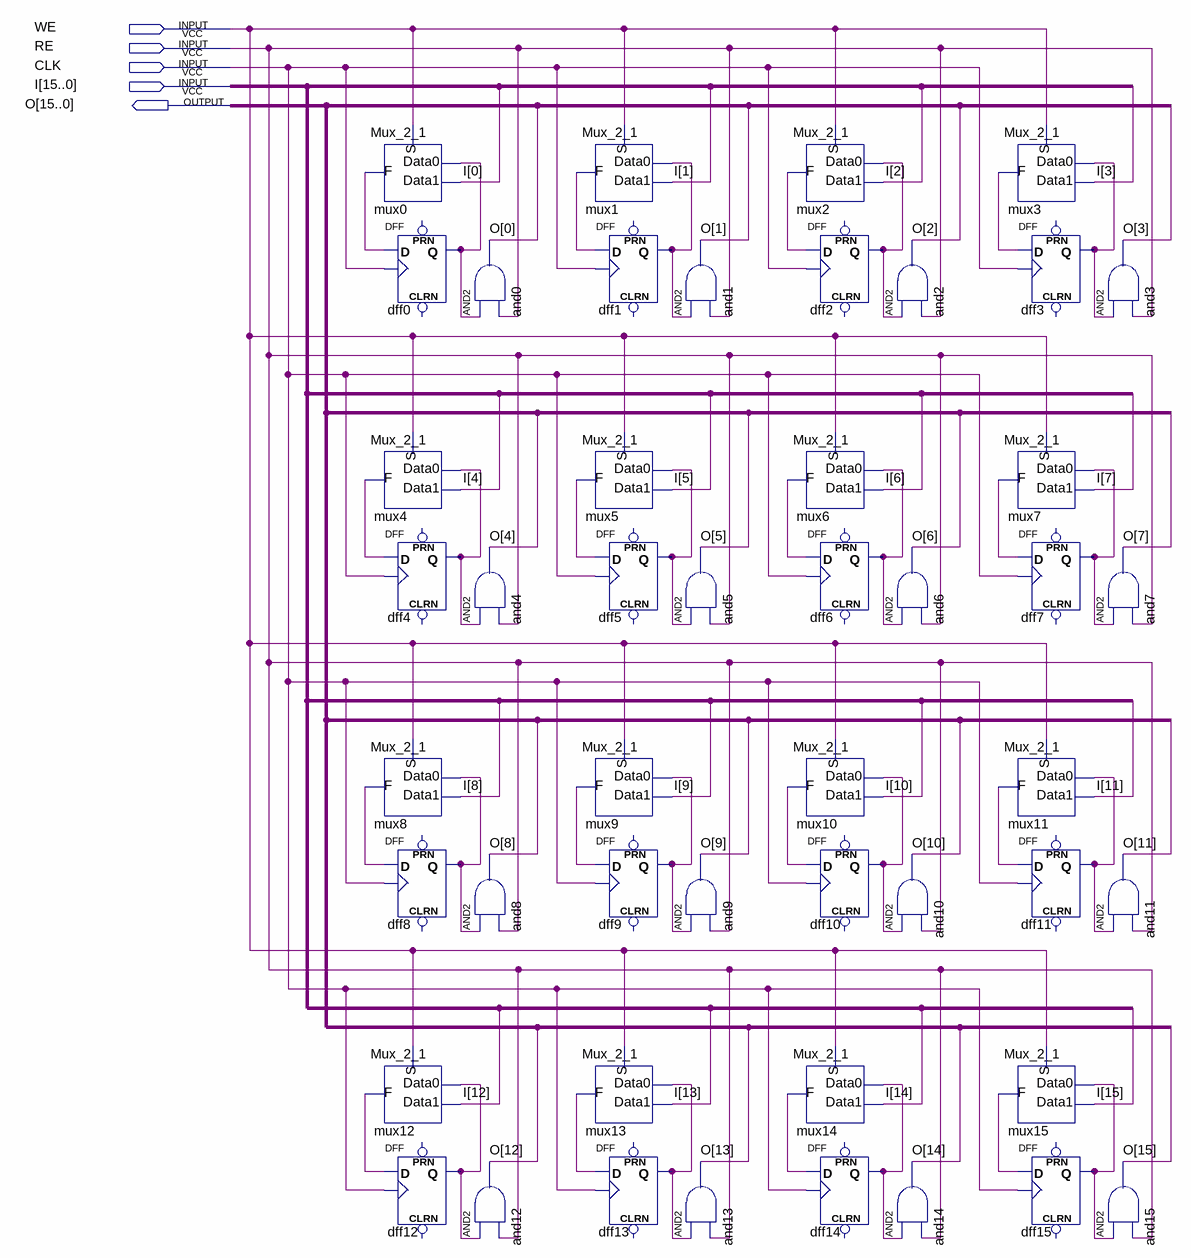
[diagram p0: schematic sheet]
// Quartus schematic Register16.bdf as structural Verilog: 48 symbols, 5 pins
module Register16 (
  input  WE,
  input  RE,
  input  CLK,
  input  [15:0] I,
  output [15:0] O
);

  wire dff0_q, dff1_q, dff2_q, dff3_q, dff4_q, dff5_q, dff6_q, dff7_q, dff8_q, dff9_q, dff10_q, dff11_q,
       dff12_q, dff13_q, dff14_q, dff15_q, mux0_f, mux1_f, mux2_f, mux3_f, mux4_f, mux5_f, mux6_f, mux7_f,
       mux8_f, mux9_f, mux10_f, mux11_f, mux12_f, mux13_f, mux14_f, mux15_f;

  Mux_2_1 mux0 (.S(WE), .Data0(dff0_q), .Data1(I[0]), .F(mux0_f));
  Mux_2_1 mux4 (.S(WE), .Data0(dff4_q), .Data1(I[4]), .F(mux4_f));
  Mux_2_1 mux8 (.S(WE), .Data0(dff8_q), .Data1(I[8]), .F(mux8_f));
  Mux_2_1 mux12 (.S(WE), .Data0(dff12_q), .Data1(I[12]), .F(mux12_f));
  DFF dff0 (.CLK(CLK), .D(mux0_f), .Q(dff0_q));  // open: CLRN, PRN
  DFF dff4 (.CLK(CLK), .D(mux4_f), .Q(dff4_q));  // open: CLRN, PRN
  DFF dff8 (.CLK(CLK), .D(mux8_f), .Q(dff8_q));  // open: CLRN, PRN
  DFF dff12 (.CLK(CLK), .D(mux12_f), .Q(dff12_q));  // open: CLRN, PRN
  and and0 (O[0], dff0_q, RE);
  and and4 (O[4], dff4_q, RE);
  and and8 (O[8], dff8_q, RE);
  and and12 (O[12], dff12_q, RE);
  Mux_2_1 mux1 (.S(WE), .Data0(dff1_q), .Data1(I[1]), .F(mux1_f));
  DFF dff1 (.CLK(CLK), .D(mux1_f), .Q(dff1_q));  // open: CLRN, PRN
  Mux_2_1 mux5 (.S(WE), .Data0(dff5_q), .Data1(I[5]), .F(mux5_f));
  DFF dff5 (.CLK(CLK), .D(mux5_f), .Q(dff5_q));  // open: CLRN, PRN
  Mux_2_1 mux9 (.S(WE), .Data0(dff9_q), .Data1(I[9]), .F(mux9_f));
  DFF dff9 (.CLK(CLK), .D(mux9_f), .Q(dff9_q));  // open: CLRN, PRN
  Mux_2_1 mux13 (.S(WE), .Data0(dff13_q), .Data1(I[13]), .F(mux13_f));
  DFF dff13 (.CLK(CLK), .D(mux13_f), .Q(dff13_q));  // open: CLRN, PRN
  and and1 (O[1], dff1_q, RE);
  and and5 (O[5], dff5_q, RE);
  and and9 (O[9], dff9_q, RE);
  and and13 (O[13], dff13_q, RE);
  Mux_2_1 mux2 (.S(WE), .Data0(dff2_q), .Data1(I[2]), .F(mux2_f));
  DFF dff2 (.CLK(CLK), .D(mux2_f), .Q(dff2_q));  // open: CLRN, PRN
  Mux_2_1 mux6 (.S(WE), .Data0(dff6_q), .Data1(I[6]), .F(mux6_f));
  DFF dff6 (.CLK(CLK), .D(mux6_f), .Q(dff6_q));  // open: CLRN, PRN
  Mux_2_1 mux10 (.S(WE), .Data0(dff10_q), .Data1(I[10]), .F(mux10_f));
  DFF dff10 (.CLK(CLK), .D(mux10_f), .Q(dff10_q));  // open: CLRN, PRN
  Mux_2_1 mux14 (.S(WE), .Data0(dff14_q), .Data1(I[14]), .F(mux14_f));
  DFF dff14 (.CLK(CLK), .D(mux14_f), .Q(dff14_q));  // open: CLRN, PRN
  and and2 (O[2], dff2_q, RE);
  and and6 (O[6], dff6_q, RE);
  and and10 (O[10], dff10_q, RE);
  and and14 (O[14], dff14_q, RE);
  Mux_2_1 mux3 (.S(WE), .Data0(dff3_q), .Data1(I[3]), .F(mux3_f));
  DFF dff3 (.CLK(CLK), .D(mux3_f), .Q(dff3_q));  // open: CLRN, PRN
  Mux_2_1 mux7 (.S(WE), .Data0(dff7_q), .Data1(I[7]), .F(mux7_f));
  DFF dff7 (.CLK(CLK), .D(mux7_f), .Q(dff7_q));  // open: CLRN, PRN
  Mux_2_1 mux11 (.S(WE), .Data0(dff11_q), .Data1(I[11]), .F(mux11_f));
  DFF dff11 (.CLK(CLK), .D(mux11_f), .Q(dff11_q));  // open: CLRN, PRN
  Mux_2_1 mux15 (.S(WE), .Data0(dff15_q), .Data1(I[15]), .F(mux15_f));
  DFF dff15 (.CLK(CLK), .D(mux15_f), .Q(dff15_q));  // open: CLRN, PRN
  and and3 (O[3], dff3_q, RE);
  and and7 (O[7], dff7_q, RE);
  and and11 (O[11], dff11_q, RE);
  and and15 (O[15], dff15_q, RE);
endmodule
